# Altium schematic sheet FLYBACK.SchDoc
size A4; SheetNumber: 3; SheetTotal: 4
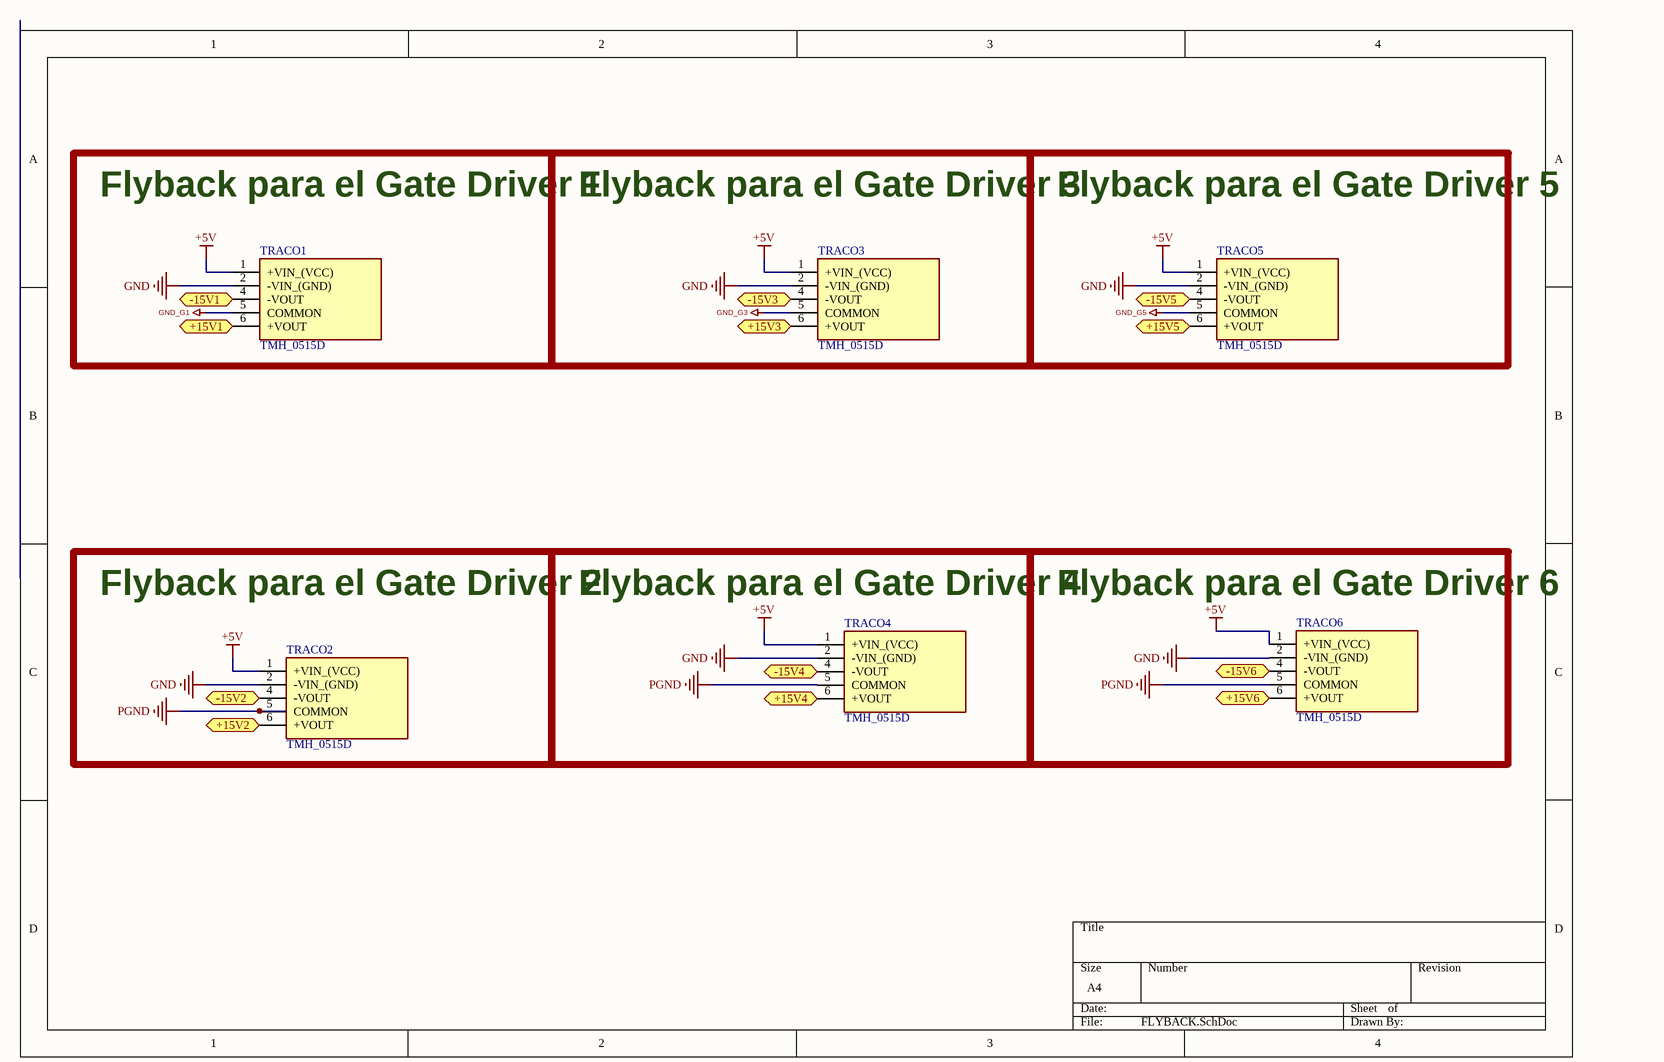
[diagram p0: FLYBACK.SchDoc]

## Parts
TRACO1  TMH_0515D  [TMH0515D]
TRACO2  TMH_0515D  [TMH0515D]
TRACO3  TMH_0515D  [TMH0515D]
TRACO4  TMH_0515D  [TMH0515D]
TRACO5  TMH_0515D  [TMH0515D]
TRACO6  TMH_0515D  [TMH0515D]

## Blocks framed on the sheet
Flyback para el Gate Driver 1: TRACO1
Flyback para el Gate Driver 3: TRACO3
Flyback para el Gate Driver 5: TRACO5
Flyback para el Gate Driver 2: TRACO2
Flyback para el Gate Driver 4: TRACO4
Flyback para el Gate Driver 6: TRACO6

## Ports
+15V1 (bidir), +15V2 (bidir), +15V3 (bidir), +15V4 (bidir), +15V5 (bidir), +15V6 (bidir), -15V1 (bidir), -15V2 (bidir), -15V3 (bidir), -15V4 (bidir), -15V5 (bidir), -15V6 (bidir)

## Nets
+5V: TRACO1.1(+VIN_(VCC)) TRACO2.1(+VIN_(VCC)) TRACO3.1(+VIN_(VCC)) TRACO4.1(+VIN_(VCC)) TRACO5.1(+VIN_(VCC)) TRACO6.1(+VIN_(VCC))
GND: TRACO1.2(-VIN_(GND)) TRACO2.2(-VIN_(GND)) TRACO3.2(-VIN_(GND)) TRACO4.2(-VIN_(GND)) TRACO5.2(-VIN_(GND)) TRACO6.2(-VIN_(GND))
GND_G1: TRACO1.5(COMMON)
GND_G3: TRACO3.5(COMMON)
GND_G5: TRACO5.5(COMMON)
PGND: TRACO2.5(COMMON) TRACO4.5(COMMON) TRACO6.5(COMMON)
+15V1: TRACO1.6(+VOUT) ; port +15V1
+15V2: TRACO2.6(+VOUT) ; port +15V2
+15V3: TRACO3.6(+VOUT) ; port +15V3
+15V4: TRACO4.6(+VOUT) ; port +15V4
+15V5: TRACO5.6(+VOUT) ; port +15V5
+15V6: TRACO6.6(+VOUT) ; port +15V6
-15V1: TRACO1.4(-VOUT) ; port -15V1
-15V2: TRACO2.4(-VOUT) ; port -15V2
-15V3: TRACO3.4(-VOUT) ; port -15V3
-15V4: TRACO4.4(-VOUT) ; port -15V4
-15V5: TRACO5.4(-VOUT) ; port -15V5
-15V6: TRACO6.4(-VOUT) ; port -15V6

## Library data of the parts
TRACO1-TRACO6 = TMH_0515D: DC/DC CONVERTER; Manufacturer_Name: Traco Power; Manufacturer_Part_Number: TMH 0515D; Nominal Input Voltage: 5V; Output Voltage: 15V; Output Current: 65mA; Number of Outputs: 2; Efficiency: 79%; Output Power: 2W; Max Input Voltage: 5.5V; Min Input Voltage: 4.5V; Voltage - Output 2: -15V; Isolation Voltage: 1kV; Isolation: Isolated; Datasheet Link: https://componentsearchengine.com//TMH 0515D.pdf; Height: 10.45mm; Mouser2 Part Number: 495-TMH-0515D; Mouser2 Price/Stock: https://www.mouser.com/Search/Refine.aspx?Keyword=495-TMH-0515D; Supplier 1: Digi-Key; Manufacturer: Traco Power; Manufacturer Part Number: TMH0515D; RoHS: Yes; Category: Voltage Regulators - Switching; Stock 1: 615; Pricing 1: 1=7.20000, 10=6.97900, 25=6.77400, 50=6.56880, 100=6.36350, 250=6.15824, 500=5.74770 (USD); Mount: Through Hole; Case/Package: SIP; Number of Pins: 5; Weight: 2.7g; Min Operating Temperature: -40°C; Max Operating Temperature: 75°C; Max Output Current: 65mA; Min Input Voltage (DC): 4.5V; Max Input Voltage (DC): 5.5V; Max Output Power: 2W; Voltage - Output 1: 15V; Current - Output 1: 65mA; Current - Output 2: 65mA; Series: TMH; Length: 19.5mm; Width: 7.5mm; Depth: 7.5mm; Radiation Hardening: No; REACH SVHC: No SVHC; Flammability Rating: UL94 V-0; RoHS Compliant: Yes; ComponentLink1URL: https://datasheet.ciiva.com/26336/157182-da-01-en-dc-dc-wandler-tmh-0515d-26336256.pdf?src-supplier=Conrad; ComponentLink1Description: https://datasheet.ciiva.com/26336/157182-da-01-en-dc-dc-wandler-tmh-0515d-26336256.pdf?src-supplier=Conrad; ComponentLink2URL: https://datasheet.ciiva.com/46393/1648746-46393670.pdf?src-supplier=Element14; ComponentLink2Description: https://datasheet.ciiva.com/46393/1648746-46393670.pdf?src-supplier=Element14; ComponentLink3URL: https://datasheet.ciiva.com/3356/tmh-eng-tds-3356425.pdf?src-supplier=Distrelec; ComponentLink3Description: https://datasheet.ciiva.com/3356/tmh-eng-tds-3356425.pdf?src-supplier=Distrelec; Supplier Part Number 1: 1951-2669-ND